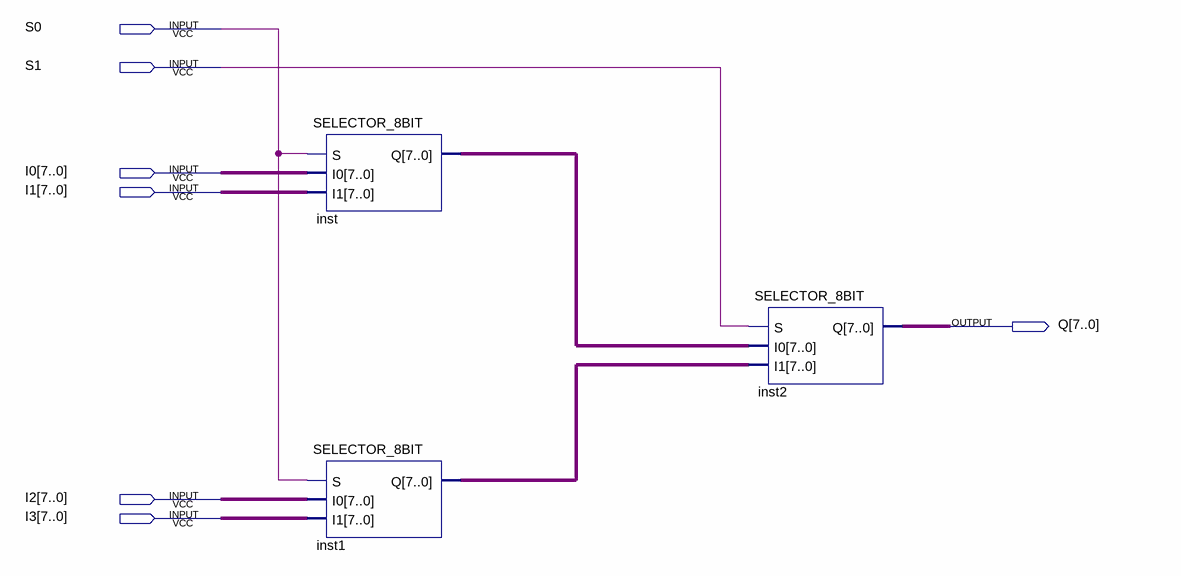
[diagram p0: schematic sheet]
// Quartus schematic MUX4_1.bdf as structural Verilog: 3 symbols, 7 pins
module MUX4_1 (
  input  S0,
  input  S1,
  input  [7:0] I0,
  input  [7:0] I1,
  input  [7:0] I2,
  input  [7:0] I3,
  output [7:0] Q
);

  wire [7:0] inst1_q, inst_q;

  SELECTOR_8BIT inst (.S(S0), .I0(I0), .I1(I1), .Q(inst_q));
  SELECTOR_8BIT inst1 (.S(S0), .I0(I2), .I1(I3), .Q(inst1_q));
  SELECTOR_8BIT inst2 (.S(S1), .I0(inst_q), .I1(inst1_q), .Q(Q));
endmodule
